# Altium schematic sheet PreAmp.SchDoc
size A; SheetNumber: 2; SheetTotal: 5
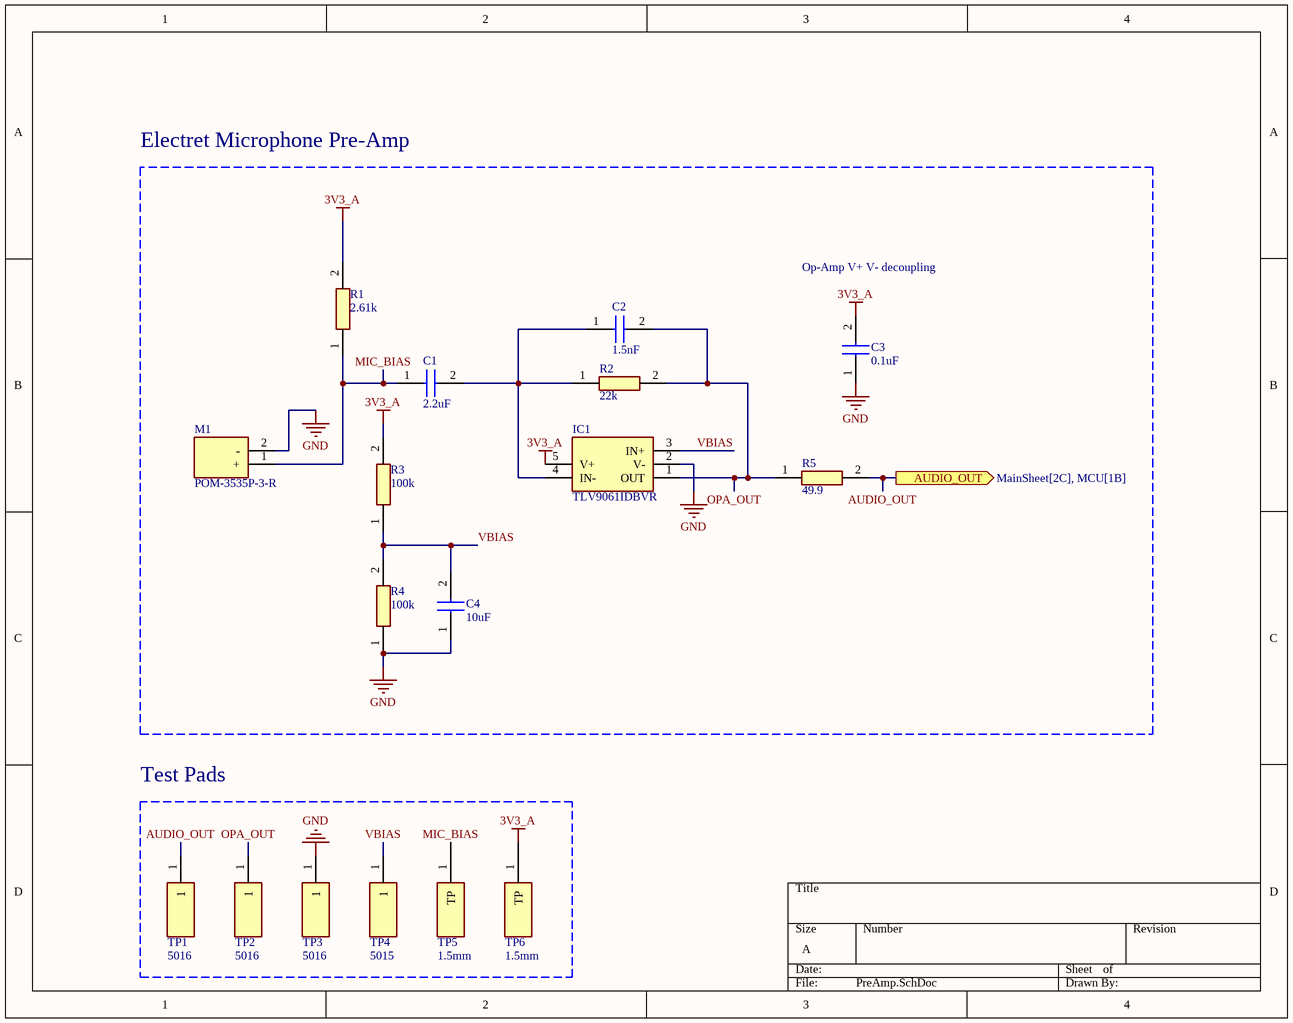
[diagram p0: PreAmp.SchDoc]

## Parts
C1  2.2uF  [C0805]
C2  1.5nF  [C0805]
C3  0.1uF  [CAPC2012X88N]
C4  10uF  [CAPC2012X140N]
IC1  TLV9061IDBVR  [SOT95P280X145-5N]
M1  POM-3535P-3-R  [POM3535P3R]
R1  2.61k  [RESC2012X60N]
R2  22k  [RESC2012X50N]
R3  100k  [RESC2012X60N]
R4  100k  [RESC2012X60N]
R5  49.9  [RESC2012X50N]
TP1  5016  [5016]
TP2  5016  [5016]
TP3  5016  [5016]
TP4  5015  [5015]
TP5  1.5mm  [TESTPAD_1P5MM]
TP6  1.5mm  [TESTPAD_1P5MM]

## Blocks framed on the sheet
Electret Microphone Pre-Amp: C1-C4 IC1 M1 R1-R5
Test Pads: TP1-TP6

## Ports
AUDIO_OUT (out, see MainSheet[2C], MCU[1B])

## Nets
3V3_A: C3.2 IC1.5(V+) R1.2 R3.2 TP6.1(TP)
GND: C3.1 C4.1 IC1.2(V-) M1.2(-) R4.1 TP3.1
AUDIO_OUT: R5.2 TP1.1 ; port AUDIO_OUT
MIC_BIAS: C1.1 M1.1(+) R1.1 TP5.1(TP)
OPA_OUT: C2.2 IC1.1(OUT) R2.2 R5.1 TP2.1
VBIAS: C4.2 IC1.3(IN+) R3.1 R4.2 TP4.1
NetC1_2: C1.2 C2.1 IC1.4(IN-) R2.1

## Notes on the sheet
- Op-Amp V+ V- decoupling

## Library data of the parts
C1 = 2.2uF Capacitor 0805: Capacitor; Manufacturer_Name: Yageo Group; Manufacturer_Part_Number: C0805C225K8PACTU; Datasheet Link: https://www.yageogroup.com/content/datasheet/asset/file/KEM_C1006_X5R_SMD; Height: 1.1mm; Mouser Part Number: 80-C0805C225K8P; Mouser Price/Stock: https://www.mouser.co.uk/ProductDetail/KEMET/C0805C225K8PACTU?qs=hIohqi1S7IpPfscGpw9Z0g%3D%3D; Arrow Part Number: C0805C225K8PACTU; Arrow Price/Stock: https://www.arrow.com/en/products/c0805c225k8pactu/kemet-corporation?region=nac
C2 = 1.5nF Capaciator 0805: Capacitor; Manufacturer_Name: Yageo Group; Manufacturer_Part_Number: C0805C152J5GACTU; Datasheet Link: https://www.yageogroup.com/content/datasheet/asset/file/KEM_C1003_C0G_SMD; Height: 1.1mm
C3 = 0.1uF Capacitor 0805: Capacitor; Manufacturer_Name: Yageo Group; Manufacturer_Part_Number: C0805C104K5RAC-TU; Datasheet Link: https://componentsearchengine.com/Datasheets/2/C0805C104K5RAC-TU.pdf; Height: 0.88mm; Arrow Part Number: C0805C104K5RAC-TU; Arrow Price/Stock: https://www.arrow.com/en/products/c0805c104k5ractu/kemet-corporation
C4 = 10uF Capacitor 0805: Capacitor; Manufacturer_Name: Yageo Group; Manufacturer_Part_Number: C0805C106K8PACTU-2.5; Datasheet Link: https://www.kemet.com/specsheet/C0805C106K8PACTU; Height: 1.4mm; Mouser Part Number: N/A; Mouser Price/Stock: https://www.mouser.com/Search/Refine.aspx?Keyword=N%2FA
IC1 = TLV9061IDBVR: Integrated Circuit; Manufacturer_Name: Texas Instruments; Datasheet Link: http://www.ti.com/lit/gpn/tlv9061; Height: 1.45mm; Manufacturer_Part_Number: TLV9061IDBVR; Mouser Part Number: 595-TLV9061IDBVR; Mouser Price/Stock: https://www.mouser.co.uk/ProductDetail/Texas-Instruments/TLV9061IDBVR?qs=w%2Fv1CP2dgqpra2GA6pq5aQ%3D%3D; Arrow Part Number: TLV9061IDBVR; Arrow Price/Stock: https://www.arrow.com/en/products/tlv9061idbvr/texas-instruments?utm_currency=USD&region=nac
M1 = Electret Microphone: Microphone; Manufacturer_Name: PUI Audio; Datasheet Link: https://componentsearchengine.com/Datasheets/1/POM-3535P-3-R.pdf; Height: 4mm; Manufacturer_Part_Number: POM-3535P-3-R; Mouser Part Number: 665-POM-3535P-3-R; Mouser Price/Stock: https://www.mouser.co.uk/ProductDetail/PUI-Audio/POM-3535P-3-R?qs=SFtkwOqhffnBMPjb%2F%2FZCSg%3D%3D
R1 = 2.61k Resistor 0805: Resistor; Manufacturer_Name: Yageo Group; Manufacturer_Part_Number: RC0805FR-072K61L; Datasheet Link: http://www.yageo.com/documents/recent/PYu-RC_Group_51_RoHS_L_10.pdf; Height: 0.6mm; Mouser Part Number: 603-RC0805FR-072K61L; Mouser Price/Stock: https://www.mouser.co.uk/ProductDetail/Yageo/RC0805FR-072K61L?qs=QrWOOBGzeCaZVRFf6Fg7Ew%3D%3D; Arrow Part Number: RC0805FR-072K61L; Arrow Price/Stock: https://www.arrow.com/en/products/rc0805fr-072k61l/yageo?region=nac
R2 = 22k Resistor 0805: Resistor; Manufacturer_Name: Vishay; Manufacturer_Part_Number: CRCW080522K0FKEA; Datasheet Link: http://www.vishay.com/docs/20035/dcrcwe3.pdf; Height: 0.5mm; Mouser Part Number: 71-CRCW0805-22K-E3; Mouser Price/Stock: https://www.mouser.co.uk/ProductDetail/Vishay-Dale/CRCW080522K0FKEA?qs=fIsz7OpyEY835T0D7WGkRw%3D%3D; Arrow Part Number: CRCW080522K0FKEA; Arrow Price/Stock: https://www.arrow.com/en/products/crcw080522k0fkea/vishay?region=europe
R3 R4 = 100k Resistor: Resistor; Manufacturer_Name: Vishay; Manufacturer_Part_Number: CRCW0805100KFKEAHP; Datasheet Link: https://componentsearchengine.com/Datasheets/1/CRCW08051R00FKEAHP.pdf; Height: 0.6mm; Mouser Part Number: 71-CRCW0805100KFKEAH; Mouser Price/Stock: https://www.mouser.co.uk/ProductDetail/Vishay-Dale/CRCW0805100KFKEAHP?qs=k2%2FDWSARqgFvzezk%252B9pwaw%3D%3D; Arrow Part Number: CRCW0805100KFKEAHP; Arrow Price/Stock: https://www.arrow.com/en/products/crcw0805100kfkeahp/vishay.html?utm_currency=USD&region=europe
R5 = 49.9 Resistor: Resistor; Manufacturer_Name: Vishay; Manufacturer_Part_Number: CRCW080549R9FKEA; Datasheet Link: http://www.vishay.com/docs/20035/dcrcwe3.pdf; Height: 0.5mm; Mouser Part Number: 71-CRCW0805-49.9-E3; Mouser Price/Stock: https://www.mouser.co.uk/ProductDetail/Vishay-Dale/CRCW080549R9FKEA?qs=kkyyugUlSrO9cI3mexpXiA%3D%3D; Arrow Part Number: CRCW080549R9FKEA; Arrow Price/Stock: https://www.arrow.com/en/products/crcw080549r9fkea/vishay
TP1-TP3 = 5016: Test Pad; Manufacturer_Name: Keystone Electronics; Datasheet Link: http://www.keyelco.com/product-pdf.cfm?p=1354; Manufacturer_Part_Number: 5016; Mouser Part Number: 534-5016; Mouser Price/Stock: https://www.mouser.co.uk/ProductDetail/Keystone-Electronics/5016?qs=qOqV1E1P08QbNAXL8l0G1A%3D%3D; Arrow Part Number: 5016; Arrow Price/Stock: https://www.arrow.com/en/products/5016/keystone-electronics?utm_currency=USD&region=europe
TP4 = 5015: Test Pad; Manufacturer_Name: Keystone Electronics; Datasheet Link: http://www.keyelco.com/product-pdf.cfm?p=1353; Height: 1.52mm; Manufacturer_Part_Number: 5015; Mouser Part Number: 534-5015; Mouser Price/Stock: https://www.mouser.co.uk/ProductDetail/Keystone-Electronics/5015?qs=qOqV1E1P08ShW56PtUq2FA%3D%3D; Arrow Part Number: 5015; Arrow Price/Stock: https://www.arrow.com/en/products/5015/keystone-electronics?utm_currency=USD&region=europe
TP5 TP6 = TEST_POINT_1PIN: 1.5mm Bare Test Pad